# Altium schematic sheet ACD_FTP01_240V_Harness.SchDoc
size Letter; DocumentNumber: ACD_FTP01_240V_Harness; SheetNumber: 1; SheetTotal: 1
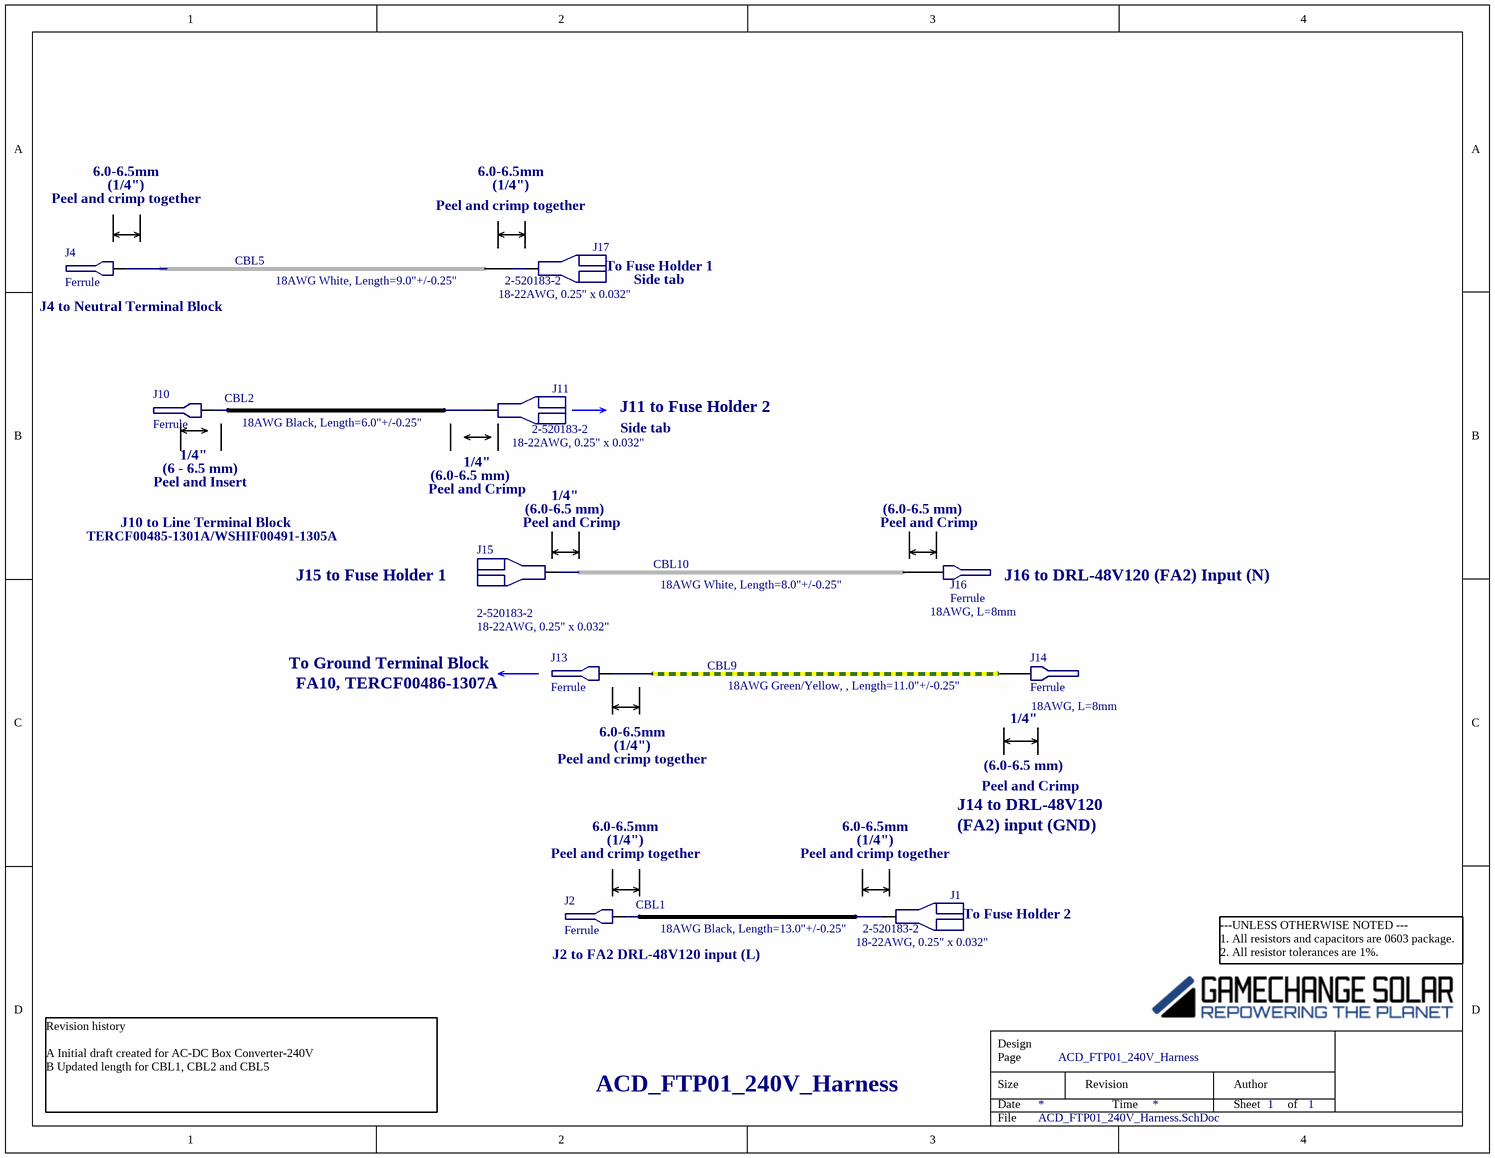
[diagram p0: ACD_FTP01_240V_Harness.SchDoc]

## Parts
CBL1  18AWG Black, Length=13.0"+/-0.25"  (mechanical)
CBL2  18AWG Black, Length=6.0"+/-0.25"  (mechanical)
CBL5  18AWG White, Length=9.0"+/-0.25"  (mechanical)
CBL9  18AWG Green/Yellow, , Length=11.0"+/-0.25"  (mechanical)
CBL10  18AWG White, Length=8.0"+/-0.25"  (mechanical)
J1  2-520183-2  Package: 18-22AWG, 0.25" x 0.032"
J2  Ferrule
J4  Ferrule
J10  Ferrule
J11  2-520183-2  Package: 18-22AWG, 0.25" x 0.032"
J13  Ferrule
J14  Ferrule  Package: 18AWG, L=8mm
J15  2-520183-2  Package: 18-22AWG, 0.25" x 0.032"
J16  Ferrule  Package: 18AWG, L=8mm
J17  2-520183-2  Package: 18-22AWG, 0.25" x 0.032"

## Nets

Not connected (* = marked no-connect by the designer): J1 1(X); J2 1(X); J4 1(X); J10 1(X); J11 1(X); J13 1(X); J14 1(X); J15 1(X); J16 1(X); J17 1(X)

## Notes on the sheet
- 6.0-6.5mm
- Peel and crimp together
- (1/4")
- To Fuse Holder 1
- Side tab
- (near J4) J4 to Neutral Terminal Block
- J11 to Fuse Holder 2
- (near J10) 1/4"
- Peel and Insert
- (near J10) (6 - 6.5 mm)
- (6.0-6.5 mm)
- Peel and Crimp
- (near J11) 1/4"
- 1/4"
- TERCF00485-1301A/WSHIF00491-1305A
- J10 to Line Terminal Block
- (near J15) Peel and Crimp
- (near J16) Peel and Crimp
- J15 to Fuse Holder 1
- J16 to DRL-48V120 (FA2) Input (N)
- To Ground Terminal Block
- FA10, TERCF00486-1307A
- (near J13) 6.0-6.5mm
- (near J14) 1/4"
- J14 to DRL-48V120
- (FA2) input (GND)
- J2 to FA2 DRL-48V120 input (L)
- To Fuse Holder 2
- Revision history
  A Initial draft created for AC-DC Box Converter-240V
  B Updated length for CBL1, CBL2 and CBL5
- ---UNLESS OTHERWISE NOTED ---
  1. All resistors and capacitors are 0603 package.
  2. All resistor tolerances are 1%.
- Design
- Size
- Date
- Page
- Revision
- Time
- Sheet
- Author
- of
- File

## Library data of the parts
CBL1 CBL2 = CBL,BLACK,18AWG: Hook-Up Wire, UL 1569, 18 AWG, Black; MFR1: Alpha Wire; MPN1: 891819 BK005; GCS PN: WIRHF00346-BK00A; Quantity: 1; MFR2: Open Source; MPN2: Open Source
CBL5 CBL10 = CBL,WHITE,18AWG: Hook-Up Wire, UL 1569, 18 AWG, White; MFR1: Alpha Wire; MPN1: 891819 WH005; GCS PN: WIRHF00347-WH00A; Quantity: 1; MFR2: Open Source; MPN2: Open Source
CBL9 = CBL,GREEN/YELLOW,18AWG: Hook-Up Wire, UL 1569, 18 AWG, Green, Yellow Stripe; MFR1: Alpha Wire; MPN1: 3055 GY005; GCS PN: WIRHF00439-GRYLA; Quantity: 1; MFR2: Open Source; MPN2: Open Source
J1 J11 J15 J17 = HDR,1x1,w0.250,0.032, CBL,F: 0.250" (6.35mm) Quick Connect Female 18-22 AWG Crimp Connector Fully Insulated; MFR1: TE Connectivity AMP Connectors; GCS PN: TERCF00297-5201A; MPN1: 2-520183-2
J2 J4 J10 J14 J16 = HDR,1X1,Ferrule,Red: Red Wire Ferrule Connector 18 AWG Single Wire; MFR1: Phoenix Contact; MPN1: 3200904; Alternative source: free of choice; GCS PN: TERFF00379-1800A
  J2 J4 J10: Package: 18AWG, L=8mm
J13 = HDR,1X1,Ferrule,Gray: Gray Wire Ferrule Connector 12 AWG Single Wire; MFR1: Phoenix Contact; MPN1: 3200535; Alternative source: free of choice; GCS PN: TERFF00383-1200A; Package: 12AWG, L=10mm